# Altium project X3_Developer_RF_V7.4.2.PrjPcb
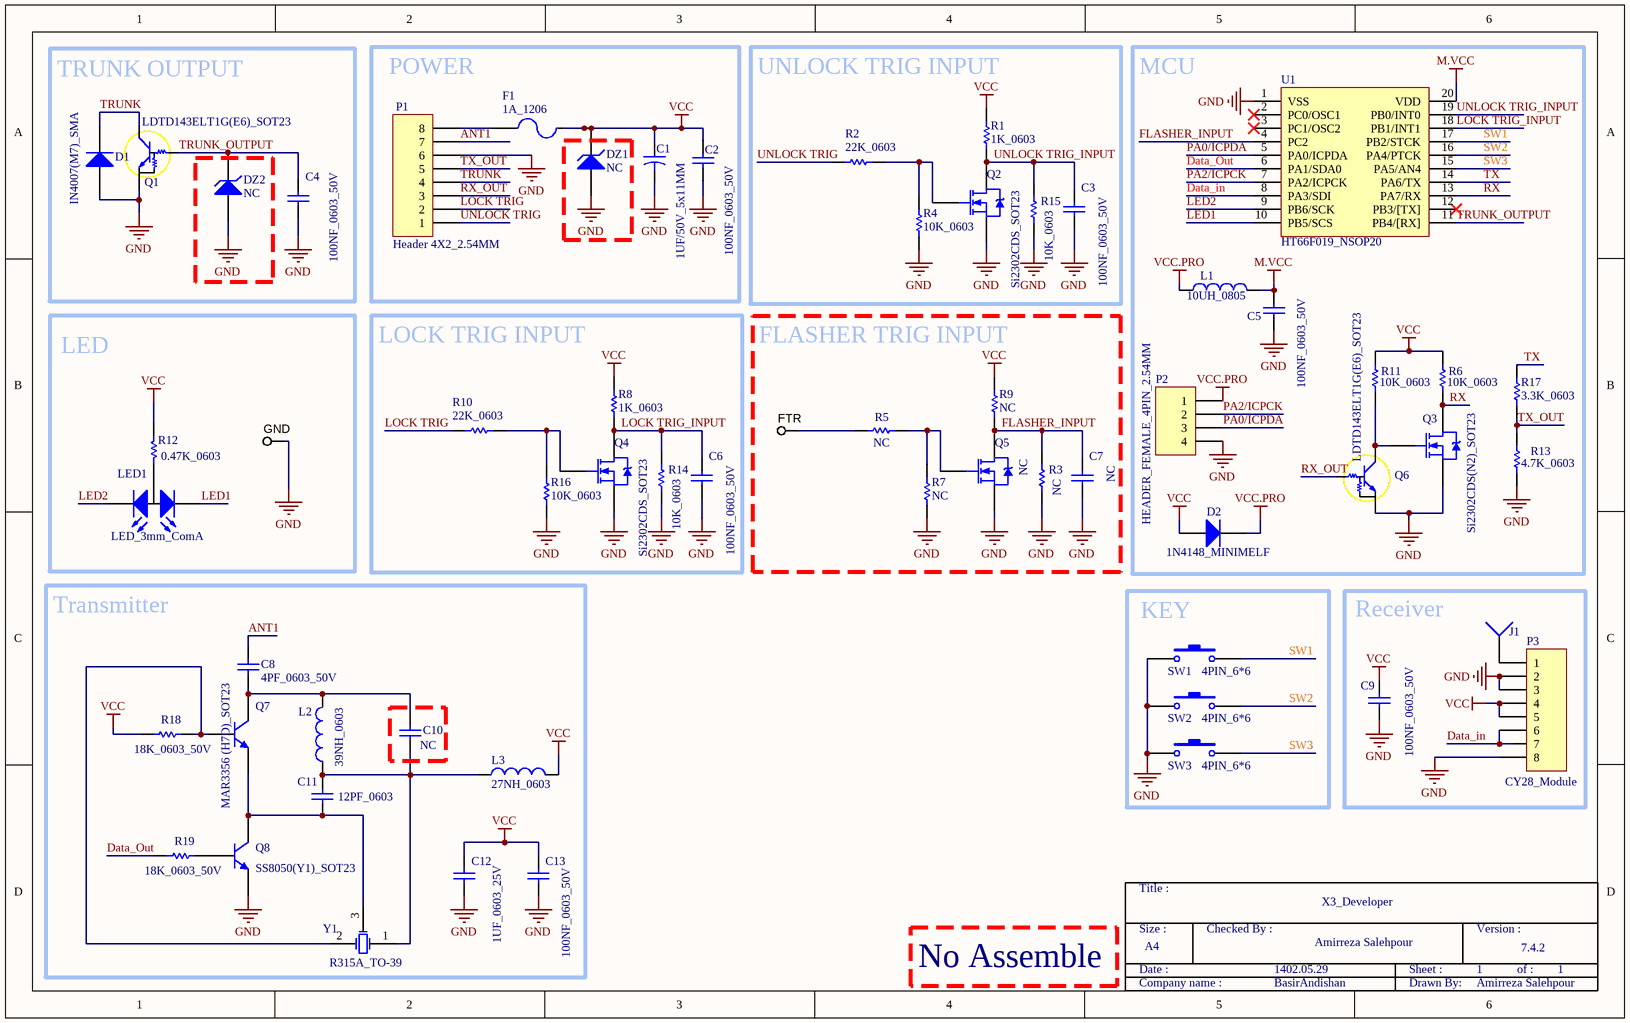
[diagram p0: X3_Developer_RF.SchDoc]
1 sheet, 60 parts. Net scope: global (net labels, ports and power ports of the same name join across sheets).
Board file: X3_Developer_RF.PcbDoc

## Sheet X3_Developer_RF.SchDoc: X3_Developer
size 304 x 190 mm; Date: 1402.05.29; CheckedBy: Amirreza Salehpour; CompanyName: BasirAndishan; DrawnBy: Amirreza Salehpour; Revision: 7.4.2; SheetNumber: 1; SheetTotal: 1

### Parts
C1  1UF/50V_5x11MM  [Cap_5mm]
C2  100NF_0603_50V  [Cap_0603_Nominal]
C3  100NF_0603_50V  [Cap_0603_Nominal]
C4  100NF_0603_50V  [Cap_0603_Nominal]
C5  100NF_0603_50V  [Cap_0603_Nominal]
C6  100NF_0603_50V  [Cap_0603_Nominal]
C7  NC  [Cap_0603_Nominal]
C8  4PF_0603_50V  [Cap_0603_Nominal]
C9  100NF_0603_50V  [Cap_0603_Nominal]
C10  NC  [Cap_0603_Nominal]
C11  value 12PF_0603  [Cap_0603_Nominal]  (hidden comment: 12PF_0603_50V)
C12  1UF_0603_25V  [Cap_0603_Nominal]
C13  100NF_0603_50V  [Cap_0603_Nominal]
D1  IN4007(M7)_SMA  [DIODE_SMA]
D2  1N4148_MINIMELF  [DIODE_MINIMELF]
DZ1  NC  [Diode_ZENER_MINIMELF]
DZ2  NC  [Diode_ZENER_MINIMELF]
F1  1A_1206  [FUSE_1206_NOMINAL]
FTR  TESTPOINT_SMD  [TPSMD_D1]  (value not drawn)  (net tie, no BOM)
GND  TESTPOINT_SMD  [TPSMD_D1]  (value not drawn)  (net tie, no BOM)
J1  ANT  [PIN1]  (value not drawn)
L1  10UH_0805  [INDUCTOR_0805_Nominal]
L2  39NH_0603  [INDUCTOR_0603_NOMINAL]
L3  27NH_0603  [INDUCTOR_0603_NOMINAL]
LED1  LED_3mm_ComA  [LED_3mm_ComA]
P1  Header 4X2_2.54MM  [CON_2X4PIN]
P2  HEADER_FEMALE_4PIN_2.54MM  [HDR_F_1X4_2mm]
P3  CY28_Module  [RF_RXB6]
Q1  LDTD143ELT1G(E6)_SOT23  [SOT23]
Q2  Si2302CDS_SOT23  [SOT23_MOSFET]
Q3  Si2302CDS(N2)_SOT23  [SOT23_MOSFET]
Q4  Si2302CDS_SOT23  [SOT23_MOSFET]
Q5  NC  [SOT23_MOSFET]
Q6  LDTD143ELT1G(E6)_SOT23  [SOT23]
Q7  MAR3356 (H7D)_SOT23  [SOT23_BJT]
Q8  SS8050(Y1)_SOT23  [SOT23_BJT]
R1  1K_0603  [Res_0603_Nominal]
R2  22K_0603  [Res_0603_Nominal]
R3  NC  [Res_0603_Nominal]
R4  10K_0603  [Res_0603_Nominal]
R5  NC  [Res_0603_Nominal]
R6  10K_0603  [Res_0603_Nominal]
R7  NC  [Res_0603_Nominal]
R8  1K_0603  [Res_0603_Nominal]
R9  NC  [Res_0603_Nominal]
R10  22K_0603  [Res_0603_Nominal]
R11  10K_0603  [Res_0603_Nominal]
R12  0.47K_0603  [Res_0603_Nominal]
R13  4.7K_0603  [Res_0603_Nominal]
R14  10K_0603  [Res_0603_Nominal]
R15  10K_0603  [Res_0603_Nominal]
R16  10K_0603  [Res_0603_Nominal]
R17  3.3K_0603  [Res_0603_Nominal]
R18  18K_0603_50V  [Res_0603_Nominal]
R19  18K_0603_50V  [Res_0603_Nominal]
SW1  4PIN_6*6  [SWITCH_DIP_6*6]
SW2  4PIN_6*6  [SWITCH_DIP_6*6]
SW3  4PIN_6*6  [SWITCH_DIP_6*6]
U1  HT66F019_NSOP20  [NSOP20]
Y1  R315A_TO-39  [CRYSTAL_TO39]

### Blocks framed on the sheet
TRUNK OUTPUT: C4 D1 DZ2 Q1
POWER: C1 C2 DZ1 F1 P1
UNLOCK TRIG INPUT: C3 Q2 R1 R2 R4 R15
MCU: C5 D2 L1 P2 Q3 Q6 R6 R11 R13 R17 U1
LED: GND LED1 R12
LOCK TRIG INPUT: C6 Q4 R8 R10 R14 R16
Transmitter: C8 C10-C13 L2 L3 Q7 Q8 R18 R19 Y1
KEY: SW1-SW3
Receiver: C9 J1 P3

### Nets
GND: C1.2 C2.1 C3.1 C4.1 C5.1 C6.1 C7.1 C9.1 C12.1 C13.1 D1.1(A) DZ1.1(A) DZ2.1(A) GND.1 P1.6 P2.4 P3.2 P3.3 P3.8 Q1.2(E) Q2.2(S) Q3.2(S) Q4.2(S) Q5.2(S) Q6.2(E) Q8.2(E) R3.2 R4.2 R7.2 R13.1 R14.2 R15.2 R16.2 SW1.1 SW2.1 SW3.1 U1.1(VSS)
M.VCC: C5.2 L1.2 U1.20(VDD)
VCC: C1.1 C2.2 C9.2 C12.2 C13.2 D2.1(A) DZ1.2(K) F1.2 L3.1 P3.4 P3.5 R1.1 R6.2 R8.1 R9.1 R11.2 R12.1 R18.2
VCC.PRO: D2.2(K) L1.1 P2.1
ANT1: C8.2 P1.7
Data_in: P3.6 P3.7 U1.8(PA3/SDI)
Data_Out: R19.1 U1.6(PA1/SDA0)
FLASHER_INPUT: C7.2 Q5.3(D) R3.1 R9.2 U1.4(PC2)
LED1: LED1.2(A2) U1.10(PB5/SCS)
LED2: LED1.1(A1) U1.9(PB6/SCK)
LOCK TRIG: P1.2 R10.2
LOCK TRIG_INPUT: C6.2 Q4.3(D) R8.2 R14.1 U1.18(PB1/INT1)
PA0/ICPDA: P2.3 U1.5(PA0/ICPDA)
PA2/ICPCK: P2.2 U1.7(PA2/ICPCK)
RX: Q3.3(D) R6.1 U1.13(PA7/RX)
RX_OUT: P1.3 Q6.1(B)
SW1: SW1.2 U1.17(PB2/STCK)
SW2: SW2.2 U1.16(PA4/PTCK)
SW3: SW3.2 U1.15(PA5/AN4)
TRUNK: D1.2(K) P1.4 Q1.3(C)
TRUNK_OUTPUT: C4.2 DZ2.2(K) Q1.1(B) U1.11(PB4/[RX])
TX: R17.1 U1.14(PA6/TX)
TX_OUT: P1.5 R13.2 R17.2
UNLOCK TRIG: P1.1 R2.2
UNLOCK TRIG_INPUT: C3.2 Q2.3(D) R1.2 R15.1 U1.19(PB0/INT0)
NetC8_1: C8.1 C10.2 L2.2 Q7.3(C)
NetC10_1: C10.1 C11.2 L2.1 L3.2 Y1.1
NetC11_1: C11.1 Q7.2(E) Q8.3(C) Y1.3
NetF1_1: F1.1 P1.8
NetFTR_1: FTR.1 R5.2
NetJ1_1: J1.1 P3.1
NetLED1_3: LED1.3(K) R12.2
NetQ2_1: Q2.1(G) R2.1 R4.1
NetQ3_1: Q3.1(G) Q6.3(C) R11.1
NetQ4_1: Q4.1(G) R10.1 R16.1
NetQ5_1: Q5.1(G) R5.1 R7.1
NetQ7_1: Q7.1(B) R18.1 Y1.2
NetQ8_1: Q8.1(B) R19.2

Not connected (* = marked no-connect by the designer): U1 2(PC0/OSC1)* 3(PC1/OSC2)* 12(PB3/[TX])*

### Notes on the sheet
- (near R9) FLASHER TRIG INPUT
- Title :
- No Assemble
- Date :
- Size :
- A4
- Checked By :
- Sheet :
- Version :
- of :
- Company name :
- Drawn By:

### Library data of the parts
C1 = Cap_Electrical
C2 C5 C8 C9 C11-C13 = Cap
  C2 C5 C9 C13: Value: 100NF_0603_50V
  C8: Value: 4PF_0603
  C12: Value: 1UF_0603_25V
C3 C4 C6 = Cap: Value: 100nF
C7 = Cap: Value: 100NF_0603_50V
C10 = Cap: Value: ?pF
D1 = Diode: Component ID: 000448
D2 = Diode
DZ1 DZ2 = Diode_Zener: Value: ZENER_5.1V_MINIMELF
F1 = FUSE
J1 = Socket: LatestRevisionDate: 17-Jul-2002; LatestRevisionNote: Re-released for DXP Platform.; Publisher: Altium Limited
L1-L3 = Inductor
  L2: Value: 39NH_0603
  L3: Value: 27NH_0603
LED1 = LED_ComA
P1 = Header 8: Header, 4-Pin; LatestRevisionDate: 17-Jul-2002; LatestRevisionNote: Re-released for DXP Platform.; Publisher: Altium Limited
P2 = Header 4: LatestRevisionDate: 17-Jul-2002; LatestRevisionNote: Re-released for DXP Platform.; Publisher: Altium Limited
P3 = RXB6: Receiver_315; LatestRevisionDate: 17-Jul-2002; LatestRevisionNote: Re-released for DXP Platform.; Publisher: Altium Limited
Q1 Q6 = NPN_Digital: Component ID: 000498
Q2 Q4 = MOSFET_N: Note: Pin 2 is electrically connected to pin 4.; Sim Note: Thermal Model provided is not called on from main Subckt.; Published: 8-Jun-2000; LatestRevisionDate: 17-Jul-2002; LatestRevisionNote: Re-released for DXP Platform.; DatasheetVersion: May-1998; PackageVersion: Feb-1997; PackageReference: TO-220AB; Publisher: Altium Limited; PackageDescription: TO, Thru-Hole, Vertical, Heatsink Mounted; 3 In-Line Leads; Pitch 2.54 mm; ComponentLink1Description: Manufacturer Link; ComponentLink1URL: http://www.irf.com/; ComponentLink2Description: Datasheet; ComponentLink2URL: http://www.irf.com/product-info/datasheets/data/irf2807.pdf
Q3 = MOSFET_N: Note: Pin 2 is electrically connected to pin 4.; Sim Note: Thermal Model provided is not called on from main Subckt.; Component ID: 002048; Published: 8-Jun-2000; LatestRevisionDate: 17-Jul-2002; LatestRevisionNote: Re-released for DXP Platform.; DatasheetVersion: May-1998; PackageVersion: Feb-1997; PackageReference: TO-220AB; Publisher: Altium Limited; PackageDescription: TO, Thru-Hole, Vertical, Heatsink Mounted; 3 In-Line Leads; Pitch 2.54 mm; ComponentLink1Description: Manufacturer Link; ComponentLink1URL: http://www.irf.com/; ComponentLink2Description: Datasheet; ComponentLink2URL: http://www.irf.com/product-info/datasheets/data/irf2807.pdf
Q5 = MOSFET_N: Si2302CDS_SOT23; Note: Pin 2 is electrically connected to pin 4.; Sim Note: Thermal Model provided is not called on from main Subckt.; Published: 8-Jun-2000; LatestRevisionDate: 17-Jul-2002; LatestRevisionNote: Re-released for DXP Platform.; DatasheetVersion: May-1998; PackageVersion: Feb-1997; PackageReference: TO-220AB; Publisher: Altium Limited; PackageDescription: TO, Thru-Hole, Vertical, Heatsink Mounted; 3 In-Line Leads; Pitch 2.54 mm; ComponentLink1Description: Manufacturer Link; ComponentLink1URL: http://www.irf.com/; ComponentLink2Description: Datasheet; ComponentLink2URL: http://www.irf.com/product-info/datasheets/data/irf2807.pdf
Q7 Q8 = NPN
R1 R2 R4 R8 R10 R16 = RES: Value: 120R
R3 R7 = RES: Value: 10K_0603
R5 = RES: Value: 22K_0603
R6 R11 = RES: Component ID: 000091; Value: 10K_0603
R9 = RES: Value: 1K_0603
R12 R18 R19 = RES
  R12: Value: 0.47K_0603
  R18 R19: Value: 18K_0603
R13 = RES: Component ID: 000098; Value: 4.7K_0603
R14 R15 = RES: Value: 1K
R17 = RES: Component ID: 000154; Value: 3.3K_0603
SW1 = SW
SW2 SW3 = SW_Right
U1 = HT66F019
Y1 = Saw_Filter: SAWFILTER
FTR GND = TESTPOINT_SMD: MANF: MANF; MANF_P#: MANF_P#; VALUE: VALUE